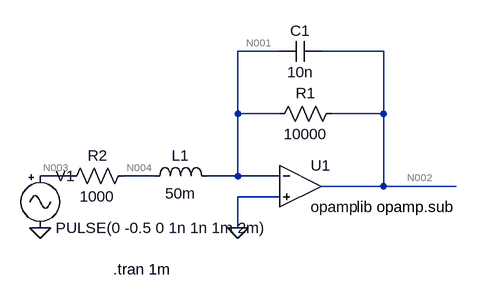
[diagram p0: schematic Draft2.asc]
Draft2.asc, the LTspice schematic file:
Version 4.1
SHEET 1 880 680
WIRE 240 16 176 16
WIRE 400 16 304 16
WIRE 176 112 176 16
WIRE 240 112 176 112
WIRE 400 112 400 16
WIRE 400 112 320 112
WIRE -80 208 -128 208
WIRE 48 208 0 208
WIRE 176 208 176 112
WIRE 176 208 128 208
WIRE 240 208 176 208
WIRE 400 224 400 112
WIRE 400 224 304 224
WIRE 512 224 400 224
WIRE 240 240 176 240
WIRE 176 288 176 240
FLAG -128 288 0
FLAG 176 288 0
SYMBOL OpAmps\\opamp 272 160 R0
SYMATTR InstName U1
SYMBOL ind 32 224 R270
WINDOW 0 32 56 VTop 2
WINDOW 3 5 56 VBottom 2
SYMATTR InstName L1
SYMATTR Value 50m
SYMBOL res 336 96 R90
WINDOW 0 0 56 VBottom 2
WINDOW 3 32 56 VTop 2
SYMATTR InstName R1
SYMATTR Value 10000
SYMBOL res 16 192 R90
WINDOW 0 0 56 VBottom 2
WINDOW 3 32 56 VTop 2
SYMATTR InstName R2
SYMATTR Value 1000
SYMBOL cap 304 0 R90
WINDOW 0 0 32 VBottom 2
WINDOW 3 32 32 VTop 2
SYMATTR InstName C1
SYMATTR Value 10n
SYMBOL Misc\\signal -128 192 R0
WINDOW 123 0 0 Left 0
WINDOW 39 0 0 Left 0
SYMATTR InstName V1
SYMATTR Value PULSE(0 -0.5 0 1n 1n 1m 2m)
TEXT -16 352 Left 2 !.tran 1m
TEXT 352 256 Left 2 !.lib opamp.sub

The netlist it stands for:
* Draft2.asc
X§U1 N001 0 N002 opamp Aol=100K GBW=10Meg  ; pins invin noninvin out
L1 N004 N001 50m
R1 N002 N001 10000
R2 N004 N003 1000
C1 N002 N001 10n
V1 N003 0 PULSE(0 -0.5 0 1n 1n 1m 2m)
.tran 1m
.lib opamp.sub
.backanno
.end

* Results of the author's LTspice run, read from the files saved beside the schematic
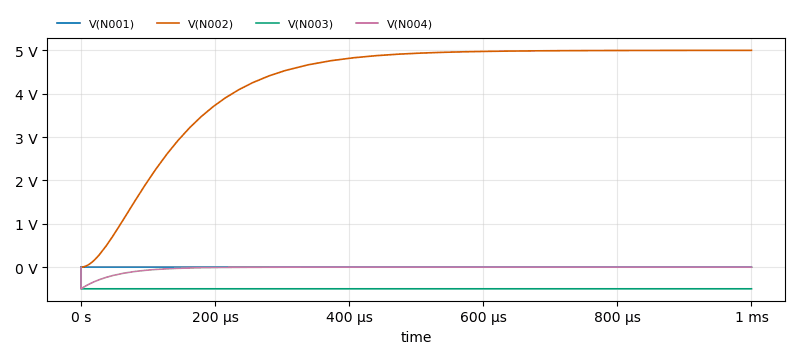
[diagram p1: Transient Analysis of Draft2.asc, plotted from the saved traces]
* Transient Analysis, 1 run:
*   V(N001): min -408.8 µV, max 0 V, average -122 µV, rms 164.3 µV, last -50.07 µV
*   V(N002): min 0 V, max 4.999 V, average 4.248 V, rms 4.447 V, last 4.999 V
*   V(N003): min -500 mV, max 0 V, average -500 mV, rms 500 mV, last -500 mV
*   V(N004): min -500 mV, max 0 V, average -25.23 mV, rms 79.42 mV, last -50.64 µV